# EAGLE design opencmpp (EAGLE 6.4)
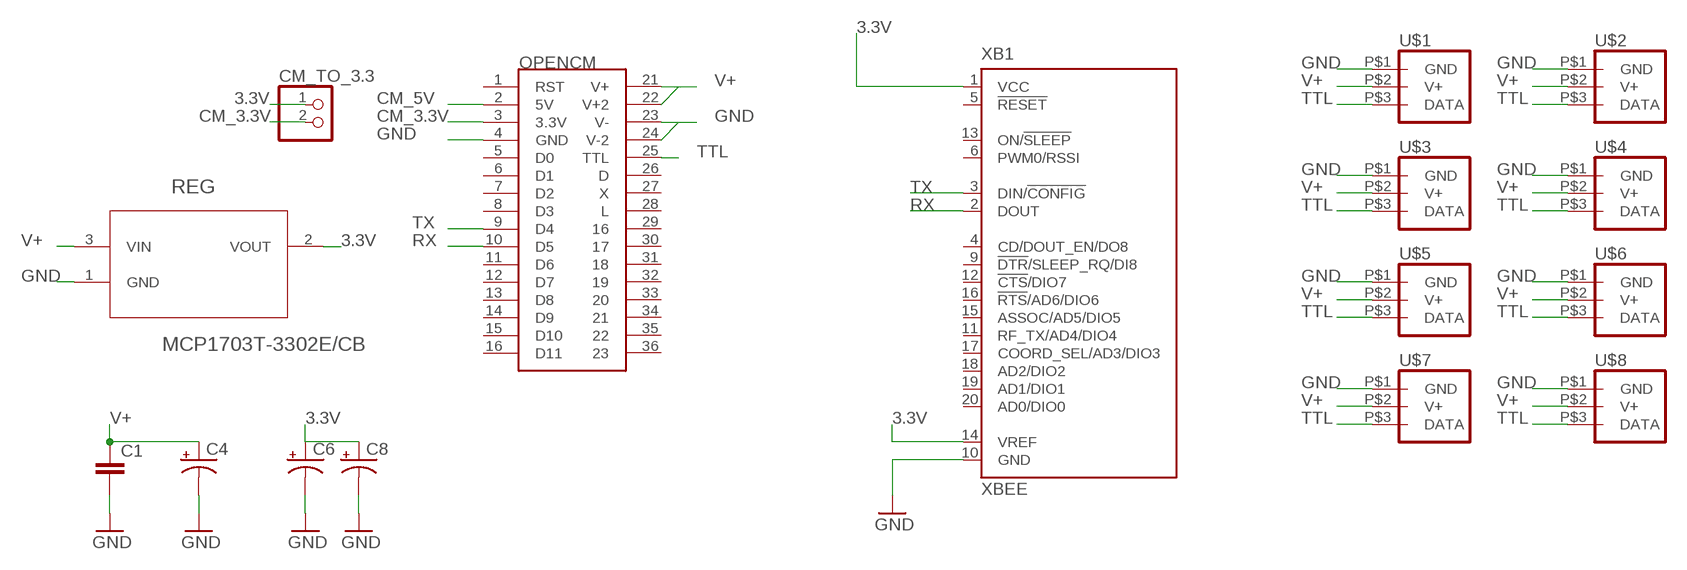
[diagram p0: schematic, sheet 1]

## Parts
C1  C-EU075-032X103  [C075-032X103]
C4  CAP_POLPTH2  [CPOL-RADIAL-10UF-25V]
C6  CAP_POLPTH2  [CPOL-RADIAL-10UF-25V]
C8  CAP_POLPTH2  [CPOL-RADIAL-10UF-25V]
CM_TO_3.3  CONNEC_1X02  [CONNEC_1X02]
OPENCM  OPENCM_REDUC  [OPENCM_REDUC]
REG  MCP1703T-3302E/CB  [SOT95P300X145-3N]
U$1  XL_320_CONNEC  [DXL_320_CONNEC]
U$2  XL_320_CONNEC  [DXL_320_CONNEC]
U$3  XL_320_CONNEC  [DXL_320_CONNEC]
U$4  XL_320_CONNEC  [DXL_320_CONNEC]
U$5  XL_320_CONNEC  [DXL_320_CONNEC]
U$6  XL_320_CONNEC  [DXL_320_CONNEC]
U$7  XL_320_CONNEC  [DXL_320_CONNEC]
U$8  XL_320_CONNEC  [DXL_320_CONNEC]
XB1  XBEE  [XBEE]

## Nets
3.3V: C6.1(+) C8.1(+) CM_TO_3.3.1 REG.2(VOUT) XB1.1(VCC) XB1.14(VREF)
CM_3.3V: CM_TO_3.3.2 OPENCM.3(3.3V)
CM_5V: OPENCM.2(5V)
GND [alime]: C1.2 C4.2(-) C6.2(-) C8.2(-) OPENCM.4(GND) OPENCM.23(V-) OPENCM.24(V-2) REG.1(GND) U$1.P$1(GND) U$2.P$1(GND) U$3.P$1(GND) U$4.P$1(GND) U$5.P$1(GND) U$6.P$1(GND) U$7.P$1(GND) U$8.P$1(GND) XB1.10(GND)
RX: OPENCM.10(D5) XB1.2(DOUT)
TTL: OPENCM.25(TTL) U$1.P$3(DATA) U$2.P$3(DATA) U$3.P$3(DATA) U$4.P$3(DATA) U$5.P$3(DATA) U$6.P$3(DATA) U$7.P$3(DATA) U$8.P$3(DATA)
TX: OPENCM.9(D4) XB1.3(DIN/!CONFIG)
V+ [alime]: C1.1 C4.1(+) OPENCM.21(V+) OPENCM.22(V+2) REG.3(VIN) U$1.P$2(V+) U$2.P$2(V+) U$3.P$2(V+) U$4.P$2(V+) U$5.P$2(V+) U$6.P$2(V+) U$7.P$2(V+) U$8.P$2(V+)
Unconnected: OPENCM.1(RST) OPENCM.5(D0) OPENCM.6(D1) OPENCM.7(D2) OPENCM.8(D3) OPENCM.11(D6) OPENCM.12(D7) OPENCM.13(D8) OPENCM.14(D9) OPENCM.15(D10) OPENCM.16(D11) OPENCM.26(D) OPENCM.27(X) OPENCM.28(L) OPENCM.29 OPENCM.30 OPENCM.31 OPENCM.32 OPENCM.33 OPENCM.34 OPENCM.35 OPENCM.36 XB1.4(CD/DOUT_EN/DO8) XB1.5(!RESET) XB1.6(PWM0/RSSI) XB1.9(!DTR!/SLEEP_RQ/DI8) XB1.11(RF_TX/AD4/DIO4) XB1.12(!CTS!/DIO7) XB1.13(ON/!SLEEP) XB1.15(ASSOC/AD5/DIO5) XB1.16(!RTS!/AD6/DIO6) XB1.17(COORD_SEL/AD3/DIO3) XB1.18(AD2/DIO2) XB1.19(AD1/DIO1) XB1.20(AD0/DIO0)

## Library data of the parts
C1 = rcl:C-EU: CAPACITOR, European symbol
C4 C6 C8 = SparkFun-Capacitors:CAP_POL: Capacitor Polarized These are standard SMD and PTH capacitors. Normally 10uF, 47uF, and 100uF in electrolytic and tantalum varieties. Always verify the external diameter of the through hole cap, it varies with capacity, voltage, and manufacturer. The EIA devices should be standard.
CM_TO_3.3 = RobotCampus:CONNEC_1X02
OPENCM = RobotCampus:OPENCM_REDUC
REG = RobotCampus:MCP1703T-3302E/CB: Low Quiescent Current LDO Regulator; MPN: MCP1703T-3302E/CB; OC_FARNELL: 1439518; OC_NEWARK: 40M0637; PACKAGE: SOT-3; SUPPLIER: Microchip
U$1-U$8 = RobotCampus:XL_320_CONNEC
XB1 = RobotCampus:XBEE: XBee (TM) /XBee-PRO(TM) OEM RF Modules Source: MaxStream, Inc. xbee_productmanual.pdf; MPN: XBP24-Z7UIT-004; OC_FARNELL: 1751799; OC_NEWARK: 34R5507

## Net classes
1 alime: width 0.508 mm

## Board
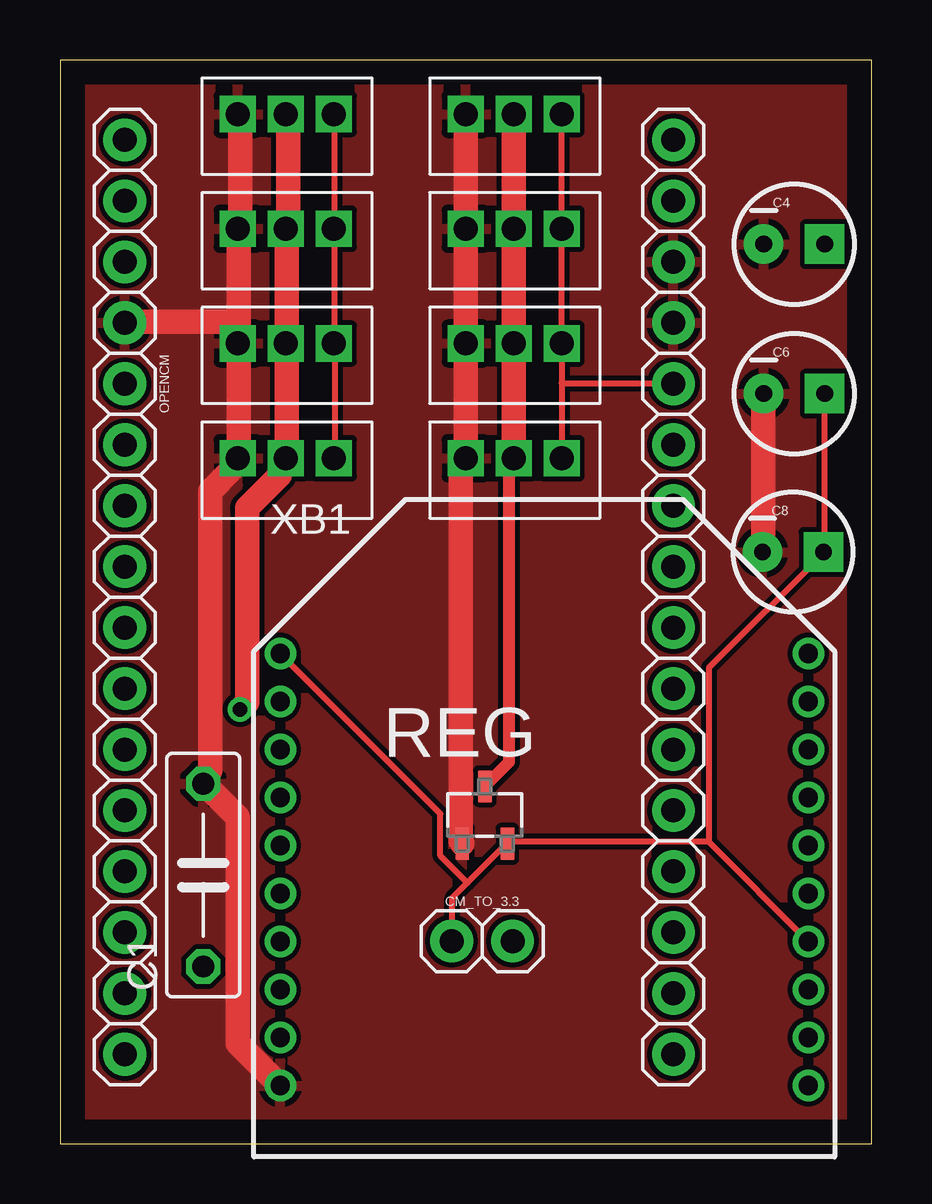
[diagram p1: board, top side]
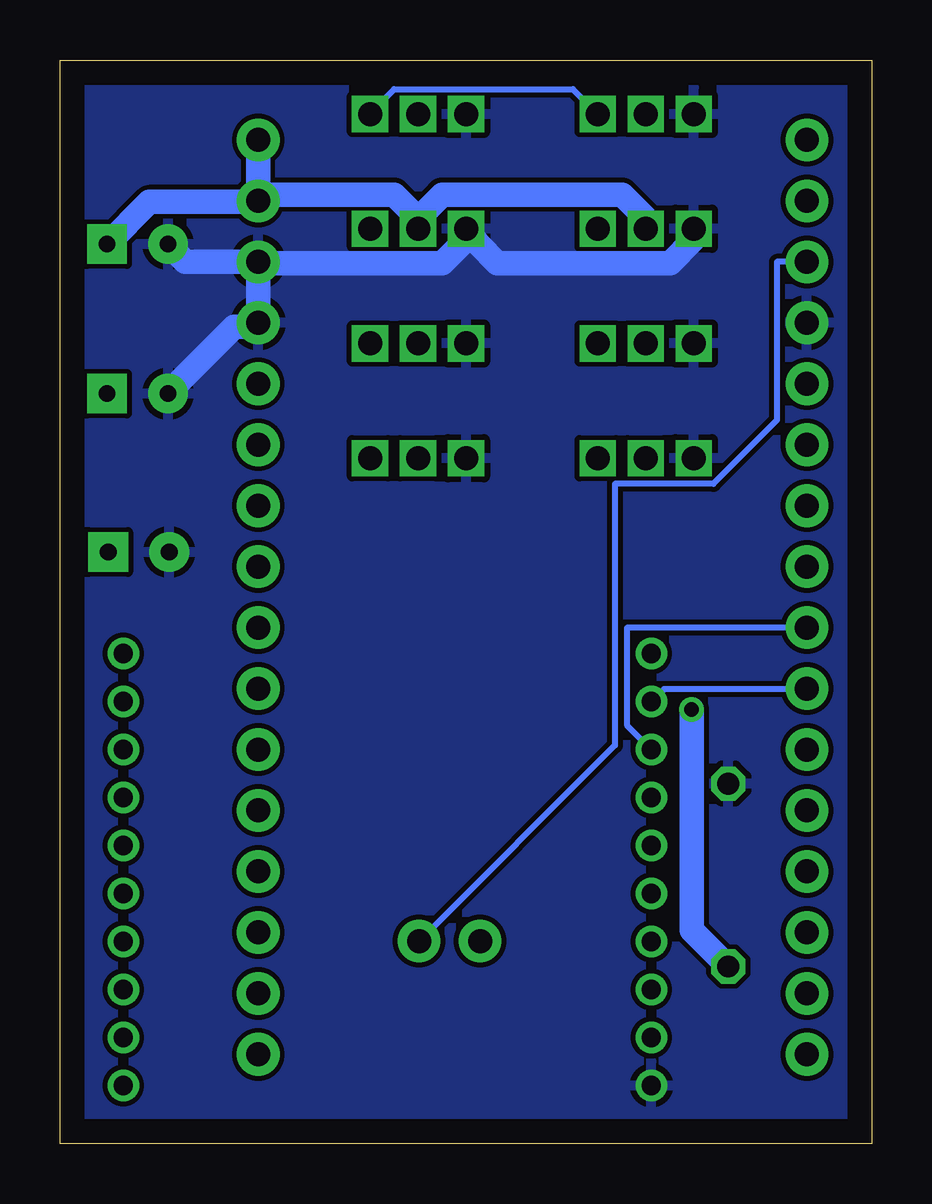
[diagram p2: board, bottom side, seen from below]

Size 33.82 x 45.16 mm. Coordinates in mm from the lower left corner, seen from the top.
Outline: 0,0 33.82,0 33.82,45.16 0,45.16 0,0
Copper layers (1*16): Top 0.035mm / dielectric 1.5mm / Bottom 0.035mm
Design rules "default": minimum track width 10mil, minimum drill 24mil, track to track 8mil, track to pad 8mil, pad to pad 8mil, via to via 8mil, smd to smd 8mil, copper to edge 40mil, drill to drill 8mil, minimum pad ring 10mil, minimum via ring 8mil, stop-mask expansion 4mil, vias tented up to drill 0mil, thermal gap 10mil

### Footprints (pad centres in the part's own frame; a part is rotated, then mirrored left to right if it is on the bottom)
C075-032X103 = drill 0.914 octagon: 1 -3.81,0; 2 3.81,0
CPOL-RADIAL-10UF-25V = drill 0.7 pad 1.651 square: 1 1.27,0 | drill 0.7 pad 1.651: 2 -1.27,0
CONNEC_1X02 = drill 1 pad 1.778: 1 -1.27,1.27; 2 1.27,1.27
OPENCM_REDUC = drill 1 pad 1.778: 1 0,-21.59; 2 2.54,-21.59; 3 5.08,-21.59; 4 7.62,-21.59; 5 10.16,-21.59; 6 12.7,-21.59; 7 15.24,-21.59; 8 17.78,-21.59; 9 20.32,-21.59; 10 22.86,-21.59; 11 25.4,-21.59; 12 27.94,-21.59; 13 30.48,-21.59; 14 33.02,-21.59; 15 35.56,-21.59; 16 38.1,-21.59; 21 0,1.27; 22 2.54,1.27; 23 5.08,1.27; 24 7.62,1.27; 25 10.16,1.27; 26 12.7,1.27; 27 15.24,1.27; 28 17.78,1.27; 29 20.32,1.27; 30 22.86,1.27; 31 25.4,1.27; 32 27.94,1.27; 33 30.48,1.27; 34 33.02,1.27; 35 35.56,1.27; 36 38.1,1.27
SOT95P300X145-3N = smd 0.559 x 1.321: 1 -0.94,-1.194; 2 0.94,-1.194; 3 0,1.194
DXL_320_CONNEC = drill 1 square: P$1 -10,2.5; P$2 -8,2.5; P$3 -6,2.5
XBEE = drill 0.8 pad 1.27: 1 -11,9; 2 -11,7; 3 -11,5; 4 -11,3; 5 -11,1; 6 -11,-1; 7 -11,-3; 8 -11,-5; 9 -11,-7; 10 -11,-9; 11 11,-9; 12 11,-7; 13 11,-5; 14 11,-3; 15 11,-1; 16 11,1; 17 11,3; 18 11,5; 19 11,7; 20 11,9

### Placement (x,y rotation side)
C1  5.97,11.2 90 top
C4  30.59,37.49 0 top
C6  30.59,31.26 0 top
C8  30.54,24.66 0 top
CM_TO_3.3  17.59,7.18 0 top
OPENCM  24.29,41.83 270 top
REG  17.7,13.7 0 top
U$1  26.9,40.41 0 top
U$2  26.9,35.63 0 top
U$3  26.9,30.85 0 top
U$4  17.41,35.63 0 top
U$5  17.41,40.41 0 top
U$6  17.41,26.07 0 top
U$7  26.9,26.07 0 top
U$8  17.41,30.85 0 top
XB1  20.18,11.43 0 top

### Tracks (layer width: path | path; a pad name or v marks a point on that pad's centre or on a via)
3.3V
  Top 0.254: C6.1 31.85,24.7 C8.1 31.75,24.55 27.05,19.85 27.05,12.7 27,12.6 | 16.98,10.88 16.35,10.25 16.35,8.45 CM_TO_3.3.1 | 16.98,10.88 18.6,12.5 REG.2 18.7,12.6 27,12.6 | 27,12.6 31.15,8.45 XB1.14 | 16.98,10.88 15.85,12 15.85,13.75 9.2,20.4 XB1.1
CM_3.3V
  Bottom 0.254: OPENCM.3 3.95,36.75 3.95,30.15 6.6,27.5 10.7,27.5 10.7,16.6 CM_TO_3.3.2
GND
  Top 1.016: C8.2 29.3,24.7 29.3,31.25 C6.2 | REG.1 16.75,12.55 16.7,12.6 16.7,28.35 16.9,28.55 U$7.P$1 U$3.P$1 U$2.P$1 U$1.P$1 | XB1.10 9.15,2.45 7.4,4.2 7.4,13.6 6,15 C1.2 6.2,15.5 6.25,15.55 6.25,27.2 7.15,28.1 U$6.P$1 7.45,28.6 7.45,33.35 U$8.P$1 7.45,33.85 7.45,34.25 | 7.45,34.25 7.45,38.1 U$4.P$1 7.5,38.65 7.5,42.85 7.45,42.9 U$5.P$1 | 7.45,34.25 2.7,34.25 OPENCM.4
  Bottom 1.016: OPENCM.23 28.6,36.75 29.3,37.45 C4.2 | OPENCM.23 25.55,36.25 25.55,34.25 OPENCM.24 26.05,34.05 26.55,34.05 29.3,31.3 C6.2 | OPENCM.23 25.05,36.65 25,36.7 17.9,36.7 16.9,37.7 U$2.P$1 16.4,37.5 15.6,36.7 8.4,36.7 7.45,37.65 7.45,38.1 U$4.P$1
  pour Top: -14.4,49.2 48,49.2 48,-4.8 -15,-4.8 -15,41.1
  pour Bottom: -7.2,51 42.6,51 42.6,-9.3 -7.2,-9.3 -7.2,47.7
RX
  Bottom 0.254: XB1.2 9.15,18.45 8.65,18.95 2.7,18.95 OPENCM.10
TTL
  Top 0.254: U$6.P$3 11.45,28.6 11.45,33.35 U$8.P$3 11.45,33.45 11.45,38.1 U$4.P$3 11.45,38.25 11.45,42.9 U$5.P$3 | 20.9,31.7 U$3.P$3 U$2.P$3 U$1.P$3 | 20.9,31.7 U$7.P$3 | 20.9,31.7 25.55,31.7 OPENCM.25
  Bottom 0.254: U$5.P$3 12.45,43.95 19.9,43.95 20.9,42.95 U$1.P$3
TX
  Bottom 0.254: XB1.3 10.2,17.45 10.2,21.5 OPENCM.9
V+  (via drill 0.61)
  Top 0.508: REG.3 18.7,15.9 18.7,28.1 U$7.P$2
  Top 1.016: U$7.P$2 U$3.P$2 U$2.P$2 U$1.P$2 | U$5.P$2 9.45,42.9 9.5,42.85 9.5,38.65 U$4.P$2 9.45,38.1 9.45,33.85 U$8.P$2 9.45,33.35 9.45,28.6 U$6.P$2 9.15,28.1 9.15,27.85 7.8,26.5 7.8,18.4 v7.5,18.1
  Bottom 1.016: C4.1 30.1,39.25 25.6,39.25 OPENCM.22 | OPENCM.21 25.55,41.8 25.55,39.75 OPENCM.22 | 18.9,38.55 19.9,39.55 25.05,39.55 OPENCM.22 | U$2.P$2 18.9,38.55 | v7.5,18.1 7.5,8.9 6,7.4 C1.1 | 18.9,38.55 17.9,39.55 10.4,39.55 9.45,38.6 9.45,38.15 U$4.P$2